# Altium schematic sheet [05] - PROFINET.SchDoc
size A3; DocumentNumber: 6; SheetNumber: 6; SheetTotal: 12
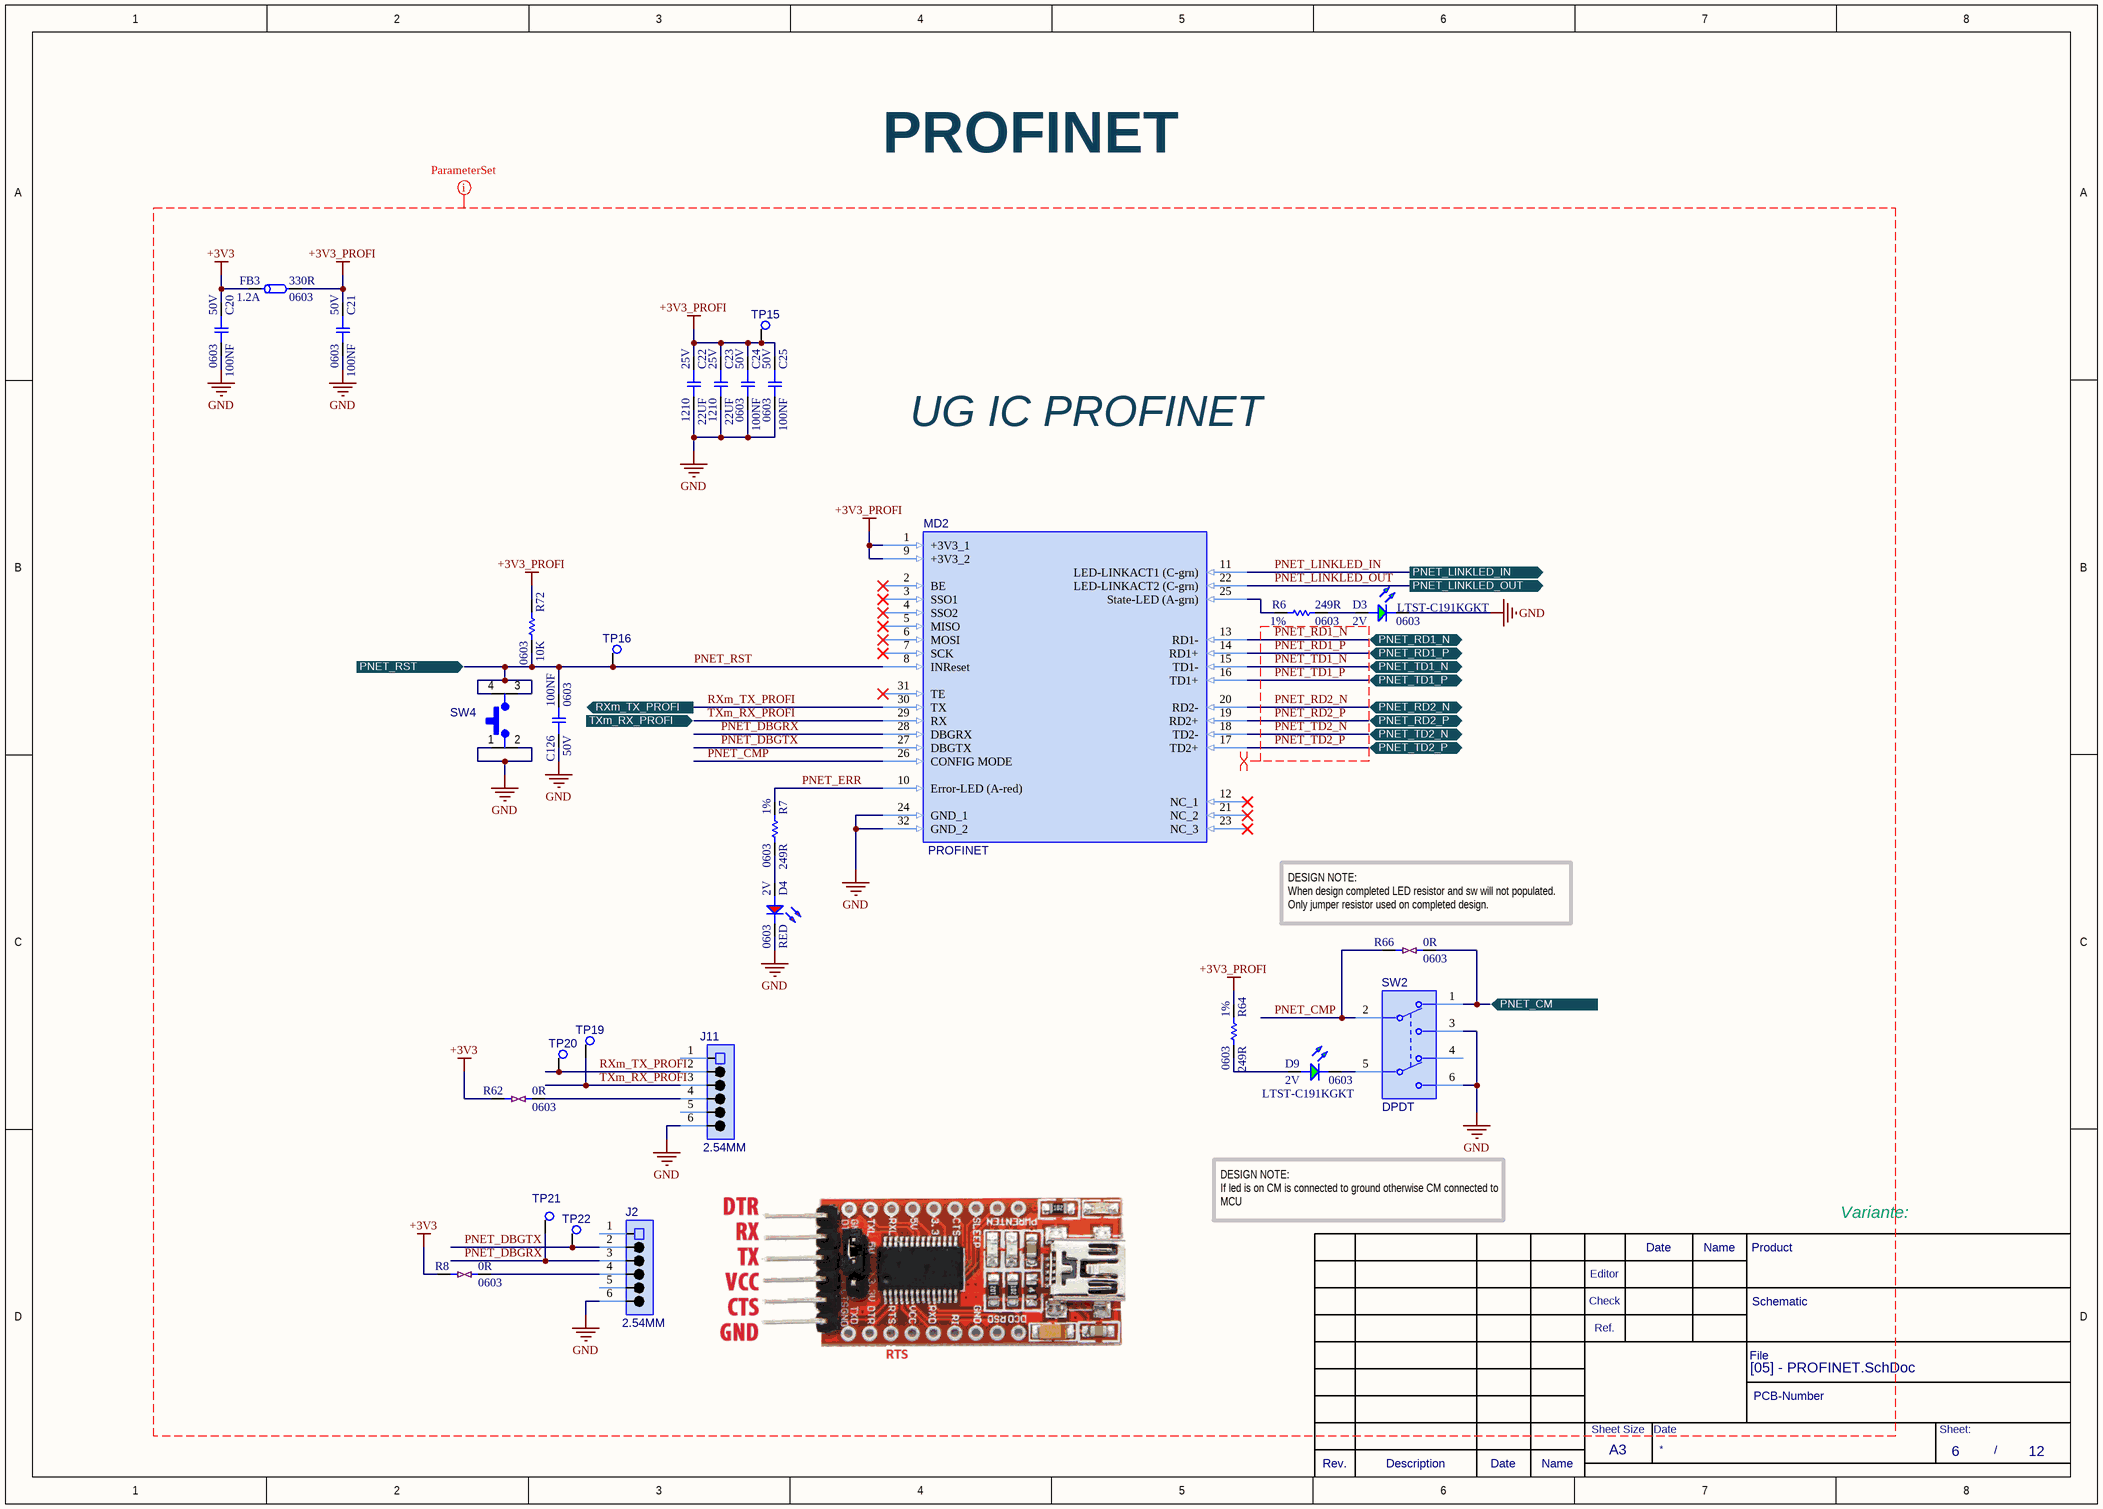
[diagram p0: [05] - PROFINET.SchDoc]

## Parts
C20  100NF  Voltage Rating: 50V  Case Code (Imperial): 0603  [C-0603]
C21  100NF  Voltage Rating: 50V  Case Code (Imperial): 0603  [C-0603]
C22  22UF  Voltage Rating: 25V  Case Code (Imperial): 1210  [C-1210]
C23  22UF  Voltage Rating: 25V  Case Code (Imperial): 1210  [C-1210]
C24  100NF  Voltage Rating: 50V  Case Code (Imperial): 0603  [C-0603]
C25  100NF  Voltage Rating: 50V  Case Code (Imperial): 0603  [C-0603]
C126  100NF  Voltage Rating: 50V  Case Code (Imperial): 0603  [C-0603]
D3  LTST-C191KGKT  Forward Voltage: 2V  Case Code (Imperial): 0603  [LED-0603-GREEN]
D4  RED  Case/Package: 0603  Forward Voltage: 2V  [LED-0603]
D9  LTST-C191KGKT  Forward Voltage: 2V  Case Code (Imperial): 0603  [LED-0603-GREEN]
FB3  330R  Case/Package: 0603  DC Current: 1.2A  [FB-0603]
J2  2.54MM  [CON-1X6-VERT-2.54MM]
J11  2.54MM  [CON-1X6-VERT-2.54MM]
MD2  PROFINET  [MD-UG-IC-PIN]
R6  249R  Tolerance: 1%  Case/Package: 0603  [R-0603]
R7  249R  Tolerance: 1%  Case/Package: 0603  [R-0603]
R8  0R  Case Code (Imperial): 0603  [JMP-0603]
R62  0R  Case Code (Imperial): 0603  [JMP-0603]
R64  249R  Tolerance: 1%  Case/Package: 0603  [R-0603]
R66  0R  Case Code (Imperial): 0603  [JMP-0603]
R72  10K  Case Code (Imperial): 0603  [R-0603]
SW2  DPDT  [SW-AYZ0202AGRLC]
SW4  SW-TACTILE-5MM  [TACTILE_SMD_V2]  (value not drawn)
TP15  MECH-TESTPOINT  [MECH-TESTPOINT]  (value not drawn)  (no BOM)
TP16  MECH-TESTPOINT  [MECH-TESTPOINT]  (value not drawn)  (no BOM)
TP19  MECH-TESTPOINT  [MECH-TESTPOINT]  (value not drawn)  (no BOM)
TP20  MECH-TESTPOINT  [MECH-TESTPOINT]  (value not drawn)  (no BOM)
TP21  MECH-TESTPOINT  [MECH-TESTPOINT]  (value not drawn)  (no BOM)
TP22  MECH-TESTPOINT  [MECH-TESTPOINT]  (value not drawn)  (no BOM)

## Ports
PNET_CM (in), PNET_LINKLED_IN (out), PNET_LINKLED_OUT (out), PNET_RD1_N (bidir), PNET_RD1_P (bidir), PNET_RD2_N (bidir), PNET_RD2_P (bidir), PNET_RST (in), PNET_TD1_N (bidir), PNET_TD1_P (bidir), PNET_TD2_N (bidir), PNET_TD2_P (bidir), RXm_TX_PROFI (out), TXm_RX_PROFI (in)

## Nets
+3V3: C20.1 FB3.1 R8.1 R62.1
+3V3_PROFI: C21.1 C22.1 C23.1 C24.1 C25.1 FB3.2 MD2.1(+3V3_1) MD2.9(+3V3_2) R64.1 R72.1 TP15.1
GND: C20.2 C21.2 C22.2 C23.2 C24.2 C25.2 C126.1 D3.C D4.C J2.6 J11.6 MD2.24(GND_1) MD2.32(GND_2) SW2.3 SW2.6 SW4.1 SW4.2
PNET_CM: R66.2 SW2.1 ; port PNET_CM
PNET_CMP: MD2.26(CONFIG_MODE) R66.1 SW2.2
PNET_DBGRX: J2.3 MD2.28(DBGRX) TP21.1
PNET_DBGTX: J2.2 MD2.27(DBGTX) TP22.1
PNET_ERR: MD2.10(Error-LED_(A-red)) R7.1
PNET_LINKLED_IN: MD2.11(LED-LINKACT1_(C-grn)) ; port PNET_LINKLED_IN
PNET_LINKLED_OUT: MD2.22(LED-LINKACT2_(C-grn)) ; port PNET_LINKLED_OUT
PNET_RD1_N: MD2.13(RD1-) ; port PNET_RD1_N
PNET_RD1_P: MD2.14(RD1+) ; port PNET_RD1_P
PNET_RD2_N: MD2.20(RD2-) ; port PNET_RD2_N
PNET_RD2_P: MD2.19(RD2+) ; port PNET_RD2_P
PNET_RST: C126.2 MD2.8(INReset) R72.2 SW4.3 SW4.4 TP16.1 ; port PNET_RST
PNET_TD1_N: MD2.15(TD1-) ; port PNET_TD1_N
PNET_TD1_P: MD2.16(TD1+) ; port PNET_TD1_P
PNET_TD2_N: MD2.18(TD2-) ; port PNET_TD2_N
PNET_TD2_P: MD2.17(TD2+) ; port PNET_TD2_P
RXm_TX_PROFI: J11.2 MD2.30(TX) TP20.1 ; port RXm_TX_PROFI
TXm_RX_PROFI: J11.3 MD2.29(RX) TP19.1 ; port TXm_RX_PROFI
NetD3_A: D3.A R6.2
NetD4_A: D4.A R7.2
NetD9_A: D9.A R64.2
NetD9_C: D9.C SW2.5
NetJ2_4: J2.4 R8.2
NetJ11_4: J11.4 R62.2
NetMD2_25: MD2.25(State-LED_(A-grn)) R6.1

Not connected (* = marked no-connect by the designer): J2 1(GND_IN) 5; J11 1(GND_IN) 5; MD2 2(BE)* 3(SSO1)* 4(SSO2)* 5(MISO)* 6(MOSI)* 7(SCK)* 12(NC_1)* 21(NC_2)* 23(NC_3)* 31(TE)*; SW2 4

## Layout directives
differential pair; differential pair class DIFF90: PNET_RD1_N, PNET_RD1_P, PNET_RD2_N, PNET_RD2_P, PNET_TD1_N, PNET_TD1_P, PNET_TD2_N, PNET_TD2_P
net class PROFINET: +3V3, +3V3_PROFI, GND, PNET_CMP, PNET_DBGRX, PNET_DBGTX, PNET_ERR, PNET_LINKLED_IN, PNET_LINKLED_OUT, PNET_RD1_N, PNET_RD1_P, PNET_RD2_N, PNET_RD2_P, PNET_RST, PNET_TD1_N, PNET_TD1_P, PNET_TD2_N, PNET_TD2_P, RXm_TX_PROFI, TXm_RX_PROFI

## Notes on the sheet
- PROFINET
- UG IC PROFINET
- (near R66) DESIGN NOTE:
  When design completed LED resistor and sw will not populated.
  Only jumper resistor used on completed design.
- DESIGN NOTE:
  If led is on CM is connected to ground otherwise CM connected to MCU
- Date
- Name
- Product
- Variante:
- Editor
- Check
- Ref.
- Schematic
- File
- PCB-Number
- Rev.
- Description
- Sheet Size
- A3
- Sheet:
- /

## Library data of the parts
C20 C21 C24 C25 = C-100NF-0603: CAP CER 0.1UF 50V X7R 0603; Manufacturer: TDK; Manufacturer Part Number: C1608X7R1H104K080AA; Tolerance: 10%; Dielectric Material: Ceramic; .PCBCHK: USED; .Creator: F:TALI; Washability: OK; Temperature Coefficient: 30ppm/°C; Mount: Surface Mount; Case/Package: 0603; Case Code (Metric): 1608; Min Operating Temperature: -55°C; Max Operating Temperature: 125°C; Package Quantity: 1; Packaging: Tape and Reel; Features: Soft Termination; Length: 1.6mm; Width: 0.8mm; Thickness: 0.037inch; Lead Free: Lead Free; Capacitance: 100nF; Supplier 1: Digi-Key; Supplier Part Number 1: 445-1314-1-ND; Stock 1: 0; Pricing 1: 1=0.1, 10=0.057, 100=0.0254, 500=0.01812, 1000=0.01423 (USD); Contact Plating: Matte,Tin; Voltage Rating (DC): 50V; Dielectric: X7R; Termination: SMD/SMT; Voltage: 50V; Height: 0.8mm; Depth: 0.8mm; REACH SVHC: No SVHC; ComponentLink1URL: http://www.mouser.com/ds/2/400/lcc_commercial_general_en-837201.pdf; ComponentLink1Description: http://www.mouser.com/ds/2/400/lcc_commercial_general_en-837201.pdf; ComponentLink2URL: https://product.tdk.com/info/en/catalog/spec/mlccspec_commercial_general_midvoltage_en.pdf; ComponentLink2Description: https://product.tdk.com/info/en/catalog/spec/mlccspec_commercial_general_midvoltage_en.pdf; Supplier 2: Digi-Key; Supplier Part Number 2: 478-3540-6-ND; Stock 2: 40000; Pricing 2: 1=0.23, 10=0.161, 100=0.0756, 500=0.05304, 1000=0.0439 (USD); Number of Pins: 2; Radiation Hardening: No; ComponentLink3URL: http://uk.rs-online.com/webdocs/13d1/0900766b813d1103.pdf; ComponentLink3Description: http://uk.rs-online.com/webdocs/13d1/0900766b813d1103.pdf; ComponentLink4URL: http://www.tdk.co.jp/tefe02/e412_c.pdf; ComponentLink4Description: http://www.tdk.co.jp/tefe02/e412_c.pdf; ComponentLink5URL: http://www.farnell.com/datasheets/2291921.pdf; ComponentLink5Description: http://www.farnell.com/datasheets/2291921.pdf; ComponentLink6URL: http://www.farnell.com/datasheets/1744655.pdf; ComponentLink6Description: http://www.farnell.com/datasheets/1744655.pdf; ComponentLink7URL: http://catalogs.avx.com/SurfaceMount.pdf; ComponentLink7Description: http://catalogs.avx.com/SurfaceMount.pdf; ComponentLink8URL: http://www.farnell.com/datasheets/630895.pdf; ComponentLink8Description: http://www.farnell.com/datasheets/630895.pdf; ComponentLink9URL: http://www.avx.com/docs/Catalogs/cx7r.pdf; ComponentLink9Description: http://www.avx.com/docs/Catalogs/cx7r.pdf; ComponentLink10URL: http://www.avx.com/docs/catalogs/cauto.pdf; ComponentLink10Description: http://www.avx.com/docs/catalogs/cauto.pdf; .SCHCHK: USED; Weight: 7.1E-05oz; Composition: Ceramic; ComponentLink11URL: https://www.verical.com/server-webapp/html/getDatasheet?partID=98691; ComponentLink11Description: https://www.verical.com/server-webapp/html/getDatasheet?partID=98691; ComponentLink12URL: https://www.avx.com/docs/Catalogs/flexiterm.pdf; ComponentLink12Description: https://www.avx.com/docs/Catalogs/flexiterm.pdf
C22 C23 = C-22UF-1210: CAP CER 22UF 25V X7R 1210; Manufacturer: Samsung; Manufacturer Part Number: CL32B226KAJNNNE; Material: Ceramic; Tolerance: 10%; .PCBCHK: CHECKED; .Creator: F:TALI; Washability: OK; Supplier 1: Digi-Key; Supplier Part Number 1: 1276-3392-1-ND; Stock 1: 0; Pricing 1: 1=1.02, 10=0.777, 100=0.556, 500=0.43042 (USD); Mount: Surface Mount; Case/Package: 1210; Case Code (Metric): 3225; Min Operating Temperature: -55°C; Max Operating Temperature: 125°C; Package Quantity: 1; Packaging: Tape and Reel; Capacitance: 22uF; Dielectric: X7R; Voltage Rating (DC): 25V; Length: 3.2mm; Height: 2.5mm; Width: 0.098inch; Thickness: 0.106inch; Depth: 2.5mm; Radiation Hardening: No; Lead Free: Lead Free; ComponentLink1URL: https://media.digikey.com/pdf/Data%20Sheets/Samsung%20PDFs/CL_Series_MLCC_ds.pdf; ComponentLink1Description: https://media.digikey.com/pdf/Data%20Sheets/Samsung%20PDFs/CL_Series_MLCC_ds.pdf; Supplier 2: Digi-Key; Supplier Part Number 2: 1276-3391-6-ND; Stock 2: 0; Pricing 2: 1=0.91, 10=0.671, 100=0.4598, 500=0.36402 (USD); ComponentLink2URL: http://www.samsungsem.com/kr/support/product-search/mlcc/CL32B226KAJNFNE.jsp; ComponentLink2Description: http://www.samsungsem.com/kr/support/product-search/mlcc/CL32B226KAJNFNE.jsp; Supplier 3: Digi-Key; Supplier Part Number 3: 399-11958-6-ND; Stock 3: 0; Pricing 3: 1=1.63, 10=1.289, 100=0.9664, 500=0.7302 (USD); Dielectric Material: Ceramic; Voltage: 25V; Dissipation Factor: 10%; Termination: SMD/SMT; .SCHCHK: CHECKED
C126 = C-100NF-0603: CAP CER 0.1UF 50V X7R 0603; Manufacturer: TDK; Manufacturer Part Number: C1608X7R1H104K080AA; Dielectric Material: Ceramic; Tolerance: 10%; Temperature Coefficient: 30ppm/°C; .PCBCHK: USED; .Creator: F:TALI; Washability: OK; Supplier 1: Digi-Key; Supplier Part Number 1: 445-1314-1-ND; Stock 1: 0; Pricing 1: 1=0.1, 10=0.057, 100=0.0254, 500=0.01812, 1000=0.01423 (USD); Mount: Surface Mount; Case/Package: 0603; Number of Pins: 2; Weight: 7.1E-05oz; Case Code (Metric): 1608; Min Operating Temperature: -55°C; Max Operating Temperature: 125°C; Capacitance: 100nF; Dielectric: X7R; Packaging: Tape and Reel; Package Quantity: 1; Termination: SMD/SMT; Voltage: 50V; Voltage Rating (DC): 50V; Composition: Ceramic; Length: 1.6mm; Height: 0.8mm; Depth: 0.8mm; Width: 0.8mm; Thickness: 0.037inch; Radiation Hardening: No; REACH SVHC: No SVHC; Lead Free: Lead Free; ComponentLink1URL: http://www.mouser.com/ds/2/400/lcc_commercial_general_en-837201.pdf; ComponentLink1Description: http://www.mouser.com/ds/2/400/lcc_commercial_general_en-837201.pdf; ComponentLink2URL: https://product.tdk.com/info/en/catalog/spec/mlccspec_commercial_general_midvoltage_en.pdf; ComponentLink2Description: https://product.tdk.com/info/en/catalog/spec/mlccspec_commercial_general_midvoltage_en.pdf; ComponentLink3URL: http://uk.rs-online.com/webdocs/13d1/0900766b813d1103.pdf; ComponentLink3Description: http://uk.rs-online.com/webdocs/13d1/0900766b813d1103.pdf; ComponentLink4URL: http://www.tdk.co.jp/tefe02/e412_c.pdf; ComponentLink4Description: http://www.tdk.co.jp/tefe02/e412_c.pdf; ComponentLink5URL: http://www.farnell.com/datasheets/2291921.pdf; ComponentLink5Description: http://www.farnell.com/datasheets/2291921.pdf; ComponentLink6URL: http://www.farnell.com/datasheets/1744655.pdf; ComponentLink6Description: http://www.farnell.com/datasheets/1744655.pdf; Supplier 2: Digi-Key; Supplier Part Number 2: 478-3540-6-ND; Stock 2: 40000; Pricing 2: 1=0.23, 10=0.161, 100=0.0756, 500=0.05304, 1000=0.0439 (USD); Contact Plating: Matte,Tin; Features: Soft Termination; ComponentLink7URL: http://catalogs.avx.com/SurfaceMount.pdf; ComponentLink7Description: http://catalogs.avx.com/SurfaceMount.pdf; ComponentLink8URL: http://www.farnell.com/datasheets/630895.pdf; ComponentLink8Description: http://www.farnell.com/datasheets/630895.pdf; ComponentLink9URL: http://www.avx.com/docs/Catalogs/cx7r.pdf; ComponentLink9Description: http://www.avx.com/docs/Catalogs/cx7r.pdf; ComponentLink10URL: http://www.avx.com/docs/catalogs/cauto.pdf; ComponentLink10Description: http://www.avx.com/docs/catalogs/cauto.pdf; ComponentLink11URL: https://www.verical.com/server-webapp/html/getDatasheet?partID=98691; ComponentLink11Description: https://www.verical.com/server-webapp/html/getDatasheet?partID=98691; ComponentLink12URL: https://www.avx.com/docs/Catalogs/flexiterm.pdf; ComponentLink12Description: https://www.avx.com/docs/Catalogs/flexiterm.pdf; .SCHCHK: USED
D3 D9 = LED-GREEN-0603: LED GREEN CLEAR 0603 SMD; Manufacturer: Vishay Lite-On; Viewing Angle: 130°; Lens Colour: Clear,Colorless; Power Rating: 75mW; Luminous Intensity: 35mcd; Lens Style: Clear,Colorless,Diffused,Rectangular; Forward Current: 30mA; Dominant Wavelength: 571nm; Test Current: 20mA; Number of Elements: 1; Wavelength: 574nm; Reverse Voltage: 5V; .PCBCHK: USED; .Creator: F:TALI; Washability: OK; ComponentLink1Description: http://www.mouser.com/ds/2/239/LTST-C191KGKT-1141954.pdf; ComponentLink1URL: http://www.mouser.com/ds/2/239/LTST-C191KGKT-1141954.pdf; ComponentLink2URL: http://optoelectronics.liteon.com/upload/download/DS22-2000-228/LTST-C191KGKT.PDF; ComponentLink2Description: http://optoelectronics.liteon.com/upload/download/DS22-2000-228/LTST-C191KGKT.PDF; Packaging: Tape and Reel; Supplier 1: Digi-Key; Supplier Part Number 1: 160-1446-1-ND; Manufacturer Part Number: LTST-C191KGKT; Stock 1: 2123523; Pricing 1: 1=0.29, 10=0.215, 25=0.16, 100=0.1153, 250=0.0798, 500=0.07088, 1000=0.05644, 2500=0.05533 (USD); Mount: Surface Mount; Case/Package: 0603; Number of Pins: 2; Colour: Green; Case Code (Metric): 1608; Min Operating Temperature: -55°C; Max Operating Temperature: 85°C; Package Quantity: 1; Illumination Colour: Green; Lens Transparency: Clear; Power Dissipation: 75mW; Number of LEDs: 1; Length: 1.6mm; Height: 0.55mm; Width: 0.8mm; Depth: 0.8mm; Radiation Hardening: No; Lead Free: Lead Free; ComponentLink3URL: https://www.verical.com/server-webapp/html/getDatasheet?partID=103913; ComponentLink3Description: https://www.verical.com/server-webapp/html/getDatasheet?partID=103913; ComponentLink4URL: http://uk.rs-online.com/webdocs/0dc0/0900766b80dc02b1.pdf; ComponentLink4Description: http://uk.rs-online.com/webdocs/0dc0/0900766b80dc02b1.pdf; ComponentLink5URL: http://www1.futureelectronics.com/doc/LITE-ON/LTST-C191KGKT.pdf; ComponentLink5Description: http://www1.futureelectronics.com/doc/LITE-ON/LTST-C191KGKT.pdf; .SCHCHK: USED
D4 = LED-RED-0603: LED RED CLEAR 0603 SMD; Manufacturer: Wurth Electronics; Manufacturer Part Number: 150060RS75000; Viewing Angle: 140°; Lens Style: Clear,Rectangular; Luminous Intensity: 250mcd; Forward Current: 30mA; Wavelength: 625nm; Test Current: 20mA; ComponentLink1Description: https://datasheet.ciiva.com/29563/150060rs75000-29563040.pdf?src-supplier=Digi-Key; ComponentLink1URL: https://datasheet.ciiva.com/29563/150060rs75000-29563040.pdf?src-supplier=Digi-Key; ComponentLink2URL: https://datasheet.ciiva.com/29279/759428-da-01-en-chipled-0603-w-kl-rot-150060rs75000-29279196.pdf?src-supplier=Conrad; ComponentLink2Description: https://datasheet.ciiva.com/29279/759428-da-01-en-chipled-0603-w-kl-rot-150060rs75000-29279196.pdf?src-supplier=Conrad; Packaging: Cut Tape; Supplier 1: Digi-Key; Supplier Part Number 1: 732-4978-1-ND; Stock: 110086; Pricing: 1=0.14, 50=0.133, 100=0.114, 500=0.099 (USD); RoHS: Yes; Mount: Surface Mount; Color: Red; Case Code (Metric): 1608; Case Code (Imperial): 0603; Min Operating Temperature: -40°C; Max Operating Temperature: 85°C; Package Quantity: 1; Dominant Wavelength: 625nm; Length: 1.6mm; Height: 0.7mm; Width: 0.8mm; REACH SVHC: Unknown
FB3 = FB-330R-0603: FERRITE BEAD 330 OHM 0603 1LN; Manufacturer: Murata; Manufacturer Part Number: BLM18PG331SN1D; Material: Steel,Ferrite; Tolerance: 25%; DC Resistance (DCR): 150mR; Number of Lines: 1; Test Frequency: 100MHz; Shielding: Unshielded; Washability: OK; .Creator: M.OZKAN; .PCBCHK: USED; Supplier 1: Digi-Key; RoHS: Yes; Number of Pins: 2; Core Material: Ferrite; Case Code (Metric): 1608; Case Code (Imperial): 0603; Min Operating Temperature: -55°C; Max Operating Temperature: 125°C; Impedance: 330R; Package Quantity: 1; Packaging: Tape and Reel; Current Rating: 1.2A; Max Current Rating: 1.2A; Termination: SMD/SMT; Number of Circuits: 1; Length: 1.75mm; Height: 0.8mm; Width: 0.8mm; Depth: 0.95mm; Radiation Hardening: No; REACH SVHC: No SVHC; Lead Free: Lead Free; ComponentLink1URL: https://datasheet.ciiva.com/6211/enfa0003-6211710.pdf?src-supplier=Digi-Key; ComponentLink1Description: https://datasheet.ciiva.com/6211/enfa0003-6211710.pdf?src-supplier=Digi-Key; Supplier Part Number 1: 490-5222-1-ND; Max DC Current: 1.2A; .SCHCHK: USED; Stock: 106218; Pricing: 1=0.1, 10=0.076, 25=0.0684, 50=0.05, 100=0.0433, 250=0.0342, 500=0.0288, 1000=0.0243 (USD)
J2 J11 = CON-6POS-2.54MM: CONN RCPT 6POS 0.1 TIN PCB; Manufacturer 1: Harwin; Manufacturer Part Number: M20-7820646; Number of Contacts: 6; Gender: Female; Connector Type: Receptacle,Socket; Max Current Rating: 3A; Contact Resistance: 20mR; Supplier 1: Digi-Key; RoHS: Yes; Category: Headers and Wire Housings; Stock: 1847; Pricing: 1=0,96000, 10=0,84200, 100=0,72600, 500=0,59400, 1000=0,52800, 5000=0,46200, 10000=0,43890 (USD); Mount: Through Hole; Case/Package: SIL; Housing Material: Nylon; Color: Black; Contact Plating: Tin; Contact Material: Bronze; Housing Color: Black; Min Operating Temperature: -40°C; Max Operating Temperature: 105°C; Termination: Solder; Number of Rows: 1; Number of Positions: 6; Packaging: Rail/Tube; Orientation: Straight; Contact Gender: Female; Package Quantity: 38; Length: 15.64mm; Pitch: 2.54mm; Depth: 2.5mm; Radiation Hardening: No; ComponentLink1URL: http://components.arrow.com/part/dataview/0323_00725884?src-supplier=Arrow+Europe; ComponentLink1Description: http://components.arrow.com/part/dataview/0323_00725884?src-supplier=Arrow+Europe; ComponentLink2URL: http://www.harwin.com/include/downloads/pdfs/2010PAGE120.PDF?src-supplier=Avnet; ComponentLink2Description: http://www.harwin.com/include/downloads/pdfs/2010PAGE120.PDF?src-supplier=Avnet; ComponentLink3URL: https://cdn.harwin.com/pdfs/M20-782.pdf?src-supplier=Digi-Key; ComponentLink3Description: https://cdn.harwin.com/pdfs/M20-782.pdf?src-supplier=Digi-Key; ComponentLink4URL: https://cdn.harwin.com/pdfs/Harwin_PC_Connectors_M20.pdf?src-supplier=Avnet+Europe; ComponentLink4Description: https://cdn.harwin.com/pdfs/Harwin_PC_Connectors_M20.pdf?src-supplier=Avnet+Europe; ComponentLink5URL: https://cdn.harwin.com/pdfs/Harwin_PC_Connectors_M20.pdf?src-supplier=RSComponents; ComponentLink5Description: https://cdn.harwin.com/pdfs/Harwin_PC_Connectors_M20.pdf?src-supplier=RSComponents; ComponentLink6URL: https://cdn.harwin.com/pdfs/Harwin_PC_Connectors_M20.pdf?src-supplier=Mouser; ComponentLink6Description: https://cdn.harwin.com/pdfs/Harwin_PC_Connectors_M20.pdf?src-supplier=Mouser; ComponentLink7URL: https://cdn.harwin.com/pdfs/Harwin_PC_Connectors_M20.pdf?src-supplier=TTI; ComponentLink7Description: https://cdn.harwin.com/pdfs/Harwin_PC_Connectors_M20.pdf?src-supplier=TTI; Supplier Part Number 1: 952-1809-ND
MD2 = MD-UG IC PROFINET: UNIGATE® IC - PROFINET 2Port; ComponentLink1Description: Datasheet; ComponentLink1URL: https://www.deutschmann.de/en/products/embedded-solutions/unigate-ic/unigate-ic-profinet/?pdf=1&id=0&bs2=0; ComponentLink2Description: Manuel; ComponentLink2URL: https://www.deutschmann.de/downloads//Marketing/Anleitung-Instructions/Handbuecher-Manuals/Gateway/English/UNIGATE%20IC/IC%20PROFINET/IC_PN2Port/IC_PN2Port_e.pdf
R6 R7 R64 = R-249R-0603: RES 249 OHM 1% 1/10W 0603; Manufacturer: Stackpole Electronics; Manufacturer Part Number: RMCF0603FT249R; Power Rating: 100mW; Temperature Coefficient: 100ppm/°C; Supplier 1: Digi-Key; Supplier Part Number 1: RMCF0603FT249RCT-ND; Stock: 137849; Pricing: 1=0.1, 10=0.015, 100=0.0063, 1000=0.0028, 2500=0.0024 (USD); RoHS: Yes; Mount: Surface Mount; Case Code (Metric): 1608; Case Code (Imperial): 0603; Contact Plating: Tin,Matte; Min Operating Temperature: -55°C; Max Operating Temperature: 155°C; Packaging: Tape and Reel; Resistance: 249R; Max Power Dissipation: 100mW; Features: Automotive AEC-Q200; Composition: Thick Film; Number of Terminations: 2; Length: 0.061inch; Height: 0.022inch; Width: 0.031inch; Radiation Hardening: No; Lead Free: Lead Free; ComponentLink1URL: http://components.arrow.com/part/dataview/50577616S9712727N1174?src-supplier=Arrow+Electronics; ComponentLink1Description: http://components.arrow.com/part/dataview/50577616S9712727N1174?src-supplier=Arrow+Electronics; ComponentLink2URL: https://www.seielect.com/catalog/SEI-RMCF_RMCP.pdf?src-supplier=Avnet; ComponentLink2Description: https://www.seielect.com/catalog/SEI-RMCF_RMCP.pdf?src-supplier=Avnet; ComponentLink3URL: https://www.seielect.com/Catalog/SEI-RMCF_RMCP.pdf?src-supplier=Digi-Key; ComponentLink3Description: https://www.seielect.com/Catalog/SEI-RMCF_RMCP.pdf?src-supplier=Digi-Key; ComponentLink4URL: https://www.seielect.com/catalog/SEI-Packaging.pdf?src-supplier=Digi-Key; ComponentLink4Description: https://www.seielect.com/catalog/SEI-Packaging.pdf?src-supplier=Digi-Key; ComponentLink5URL: http://www.seielect.com/Catalog/SEI-RMC.pdf?src-supplier=Future+Electronics; ComponentLink5Description: http://www.seielect.com/Catalog/SEI-RMC.pdf?src-supplier=Future+Electronics
R8 R62 R66 = R-0R-0603: RES SMD 0 OHM 1/10W JUMP 0603; Manufacturer: Yageo; Manufacturer Part Number: RC0603JR-070RL; Resistance: 0mR; Tolerance: 1%; Power Rating: 100mW; Voltage Rating: 50V; Temperature Coefficient: 200ppm/°C; Current Rating: 1A; Working Voltage: 75V; .PCBCHK: USED; .Creator: F:TALI; Washability: OK; Supplier 1: Digi-Key; Supplier Part Number 1: 311-0.0GRDKR-ND; Stock 1: 54397731; Pricing 1: 1=0.1, 10=0.021, 25=0.0152, 50=0.0114, 100=0.0084, 250=0.00644, 500=0.00514, 1000=0.00379 (USD); Case/Package: 0603; Number of Pins: 2; Contact Plating: Matte,Tin; Case Code (Metric): 1608; Min Operating Temperature: -55°C; Max Operating Temperature: 155°C; Composition: Thick Film; Packaging: Tape and Reel; Voltage Rating (DC): 50V; Termination: SMD/SMT; Military Standard: Not; Length: 1.6mm; Height: 0.45mm; Width: 0.8mm; Depth: 0.8mm; Radiation Hardening: No; REACH SVHC: No SVHC; Lead Free: Lead Free; ComponentLink1URL: http://www.farnell.com/datasheets/1738695.pdf; ComponentLink1Description: http://www.farnell.com/datasheets/1738695.pdf; ComponentLink2URL: https://www.verical.com/server-webapp/html/getDatasheet?partID=329462; ComponentLink2Description: https://www.verical.com/server-webapp/html/getDatasheet?partID=329462; ComponentLink3URL: http://www.yageo.com/documents/recent/PYu-RC_Group_51_RoHS_L_9.pdf; ComponentLink3Description: http://www.yageo.com/documents/recent/PYu-RC_Group_51_RoHS_L_9.pdf; Supplier Part Number 2: 311-0.0HRDKR-ND; Stock 2: 6104331; Pricing 2: 1=0.1, 10=0.021, 25=0.0152, 50=0.0114, 100=0.0084, 250=0.00644, 500=0.00514, 1000=0.00379 (USD); Supplier 2: Digi-Key; Package Quantity: 5000; Number of Terminations: 2; Max Power Dissipation: 100mW; Features: Moisture Resistant; ComponentLink4URL: http://www.farnell.com/datasheets/443971.pdf; ComponentLink4Description: http://www.farnell.com/datasheets/443971.pdf; ComponentLink5URL: http://documents.rs-components.com/techlib://itc_doclist_GB.htm?stockno=6515918; ComponentLink5Description: http://documents.rs-components.com/techlib://itc_doclist_GB.htm?stockno=6515918; ComponentLink6URL: http://www.farnell.com/datasheets/1868787.pdf; ComponentLink6Description: http://www.farnell.com/datasheets/1868787.pdf; ComponentLink7URL: http://documents.rs-components.com/techlib://itc_doclist_GB.htm?stockno=5048827; ComponentLink7Description: http://documents.rs-components.com/techlib://itc_doclist_GB.htm?stockno=5048827; Supplier 3: Digi-Key; Supplier Part Number 3: P0.0GDKR-ND; Stock 3: 34178498; Pricing 3: 1=0.1, 10=0.042, 25=0.0304, 50=0.0232, 100=0.0171, 250=0.01308, 500=0.01046, 1000=0.0077 (USD); Mount: Surface Mount; ComponentLink8URL: http://industrial.panasonic.com/www-data/pdf/AOA0000/AOA0000CE1.pdf; ComponentLink8Description: http://industrial.panasonic.com/www-data/pdf/AOA0000/AOA0000CE1.pdf; ComponentLink9URL: http://www.farnell.com/datasheets/2059623.pdf; ComponentLink9Description: http://www.farnell.com/datasheets/2059623.pdf; ComponentLink10URL: http://www.jameco.com/Jameco/Products/ProdDS/1935748.pdf; ComponentLink10Description: http://www.jameco.com/Jameco/Products/ProdDS/1935748.pdf; ComponentLink11URL: http://www.farnell.com/datasheets/1678796.pdf; ComponentLink11Description: http://www.farnell.com/datasheets/1678796.pdf; .SCHCHK: USED; ComponentLink12URL: http://www.alliedelec.com/m/d/51cd0790071e1666bdb9d00c57fcf960.pdf; ComponentLink12Description: http://www.alliedelec.com/m/d/51cd0790071e1666bdb9d00c57fcf960.pdf
R72 = R-10K-0603: RES SMD 10K OHM 1% 1/10W 0603; Manufacturer: Yageo; Manufacturer Part Number: RC0603FR-0710KL; Resistance: 10kR; Temperature Coefficient: 100ppm/°C; Voltage Rating (DC): 50V; Power Rating: 100mW; Voltage Rating: 75V; .PCBCHK: USED; .Creator: F:TALI; Washability: OK; Supplier 1: Digi-Key; Supplier Part Number 1: 311-10.0KHRCT-ND; Stock 1: 37479107; Pricing 1: 1=0.1, 10=0.026, 100=0.0107, 1000=0.00478, 2500=0.00415 (USD); Case/Package: 0603; Number of Pins: 2; Weight: 7.1E-05oz; Case Code (Metric): 1608; Min Operating Temperature: -55°C; Max Operating Temperature: 155°C; Tolerance: 1%; Composition: Thick Film; Packaging: Tape and Reel; Military Standard: Not; Termination: SMD/SMT; Length: 1.6mm; Height: 0.45mm; Width: 0.8mm; Depth: 0.8mm; Lead Pitch: 0.3mm; REACH SVHC: No SVHC; Lead Free: Lead Free; ComponentLink1URL: http://www.farnell.com/datasheets/38590.pdf; ComponentLink1Description: http://www.farnell.com/datasheets/38590.pdf; ComponentLink2URL: https://www.verical.com/server-webapp/html/getDatasheet?partID=409289; ComponentLink2Description: https://www.verical.com/server-webapp/html/getDatasheet?partID=409289; ComponentLink3URL: http://www.farnell.com/datasheets/1868787.pdf; ComponentLink3Description: http://www.farnell.com/datasheets/1868787.pdf; ComponentLink4URL: http://www.farnell.com/datasheets/443971.pdf; ComponentLink4Description: http://www.farnell.com/datasheets/443971.pdf; ComponentLink5URL: http://www.farnell.com/datasheets/1738695.pdf; ComponentLink5Description: http://www.farnell.com/datasheets/1738695.pdf; Supplier 2: Digi-Key; Supplier Part Number 2: 311-10KGRDKR-ND; Stock 2: 34952003; Pricing 2: 1=0.1, 10=0.022, 100=0.0088, 1000=0.00396, 2500=0.00344 (USD); Contact Plating: Matte,Tin; Radiation Hardening: No; ComponentLink6URL: http://www.yageo.com/documents/recent/PYu-RC_Group_51_RoHS_L_9.pdf; ComponentLink6Description: http://www.yageo.com/documents/recent/PYu-RC_Group_51_RoHS_L_9.pdf; ComponentLink7URL: https://www.verical.com/server-webapp/html/getDatasheet?partID=327958; ComponentLink7Description: https://www.verical.com/server-webapp/html/getDatasheet?partID=327958; ComponentLink8URL: http://www.yageo.com/documents/recent/PYu-RC_Group_51_RoHS_L_2.pdf; ComponentLink8Description: http://www.yageo.com/documents/recent/PYu-RC_Group_51_RoHS_L_2.pdf; Mount: Surface Mount; Package Quantity: 1; Number of Terminations: 2; Max Power Dissipation: 100mW; Working Voltage: 75V; Features: Automotive AEC-Q200; ComponentLink9URL: http://www.farnell.com/datasheets/1678796.pdf; ComponentLink9Description: http://www.farnell.com/datasheets/1678796.pdf; ComponentLink10URL: http://industrial.panasonic.com/www-cgi/jvcr13pz.cgi?E+PZ+3+AOA0002+ERJ1GNJ120C+7+WW; ComponentLink10Description: http://industrial.panasonic.com/www-cgi/jvcr13pz.cgi?E+PZ+3+AOA0002+ERJ1GNJ120C+7+WW; ComponentLink11URL: http://industrial.panasonic.com/www-data/pdf/AOA0000/AOA0000CE1.pdf; ComponentLink11Description: http://industrial.panasonic.com/www-data/pdf/AOA0000/AOA0000CE1.pdf; ComponentLink12URL: http://www.jameco.com/Jameco/Products/ProdDS/2007265.pdf; ComponentLink12Description: http://www.jameco.com/Jameco/Products/ProdDS/2007265.pdf; ComponentLink13URL: https://industrial.panasonic.com/cdbs/www-data/pdf/RDA0000/AOA0000C301.pdf; ComponentLink13Description: https://industrial.panasonic.com/cdbs/www-data/pdf/RDA0000/AOA0000C301.pdf; Supplier 3: Digi-Key; Supplier Part Number 3: YAG1290DKR-ND; Stock 3: 0; Pricing 3: 1=0.1, 10=0.044, 100=0.0178, 1000=0.00798, 2500=0.00693 (USD); .SCHCHK: USED
SW2 = SW-AYZ0202AGRLC: SWITCH SLIDE DPDT 100MA 12V; Manufacturer: ITT C&K; Mechanical Life: 10000Cycles; Actuator Material: Nylon,Glass,Polyamide,Glass fibre; Actuator Type: Standard; Illumination Type: Non-Illuminated; Contact Resistance: 80mR; Switch Function: On-On; Actuator Length: 1mm; Supplier 1: RSComponents; Supplier Part Number 1: 7931504; Manufacturer Part Number: AYZ0202AGRLC; Stock: 377; Pricing: 1=1.326, 50=1.209, 100=1.105, 1000=1.027, 3000=0.962, 1=10.2, 50=9.3, 100=8.5, 1000=7.9, 3000=7.4 (EUR); RoHS: Yes; Mount: Surface Mount,PCB; Case/Package: 100; Contact Material: Copper Alloy,Brass,Silver; Housing Material: Glass; Contact Plating: Silver; Min Operating Temperature: -10°C; Max Operating Temperature: 60°C; Termination: Gull Wing; Throw Configuration: DPDT; Max Current Rating: 100mA; Max Voltage Rating (DC): 12V; Voltage Rating (DC): 12V; Package Quantity: 1; Packaging: Tape and Reel; Current Rating: 100mA; Contact Current Rating: 100mA; Orientation: Vertical; Length: 7.2mm; Depth: 6mm; Radiation Hardening: No; Lead Free: Lead Free; REACH SVHC: No SVHC; ComponentLink1URL: https://datasheet.ciiva.com/16417/ayz0202agrlc-16417120.pdf?src-supplier=Future+Electronics; ComponentLink1Description: https://datasheet.ciiva.com/16417/ayz0202agrlc-16417120.pdf?src-supplier=Future+Electronics; ComponentLink2URL: https://datasheet.ciiva.com/2889/ayz-16oct13-2889189.pdf?src-supplier=Digi-Key; ComponentLink2Description: https://datasheet.ciiva.com/2889/ayz-16oct13-2889189.pdf?src-supplier=Digi-Key; ComponentLink3URL: https://datasheet.ciiva.com/8624/ayz-16oct13-8624741.pdf?src-supplier=Avnet; ComponentLink3Description: https://datasheet.ciiva.com/8624/ayz-16oct13-8624741.pdf?src-supplier=Avnet; ComponentLink4URL: https://datasheet.ciiva.com/2889/ayz-16oct13-2889190.pdf?src-supplier=Digi-Key; ComponentLink4Description: https://datasheet.ciiva.com/2889/ayz-16oct13-2889190.pdf?src-supplier=Digi-Key; ComponentLink5URL: https://datasheet.ciiva.com/2889/ayz-16oct13-2889191.pdf?src-supplier=Digi-Key; ComponentLink5Description: https://datasheet.ciiva.com/2889/ayz-16oct13-2889191.pdf?src-supplier=Digi-Key; ComponentLink6URL: https://datasheet.ciiva.com/16174/ayz-24mar-16174248.pdf?src-supplier=Onlinecomponents.com; ComponentLink6Description: https://datasheet.ciiva.com/16174/ayz-24mar-16174248.pdf?src-supplier=Onlinecomponents.com; ComponentLink7URL: https://datasheet.ciiva.com/22630/1707705-22630555.pdf?src-supplier=Element14; ComponentLink7Description: https://datasheet.ciiva.com/22630/1707705-22630555.pdf?src-supplier=Element14
SW4 = SW-TACTILE-5MM: SWITCH TACTILE SPST-NO 0.05A 24V; Manufacturer: TE Connectivity AMP; Manufacturer Part Number: FSM4JSMA; Mechanical Life: 100000Cycles; Actuator Material: Polyamide; Operating Force: 1.57N; Throw Configuration: SPST; Max Voltage Rating (DC): 12V; Current Rating: 50mA; Illumination Type: Illuminated,Non-Illuminated; Contact Resistance: 100mR; Switch Travel: 0.25mm; Switch Function: Off-Mom; Actuator Type: Standard; Actuator Length: 0.055inch; .PCBCHK: USED; .Creator: F:TALI; Washability: OK; Supplier 1: Digi-Key; Stock 1: 31344; Pricing 1: 1=0.23, 10=0.218, 25=0.2108, 50=0.2032, 100=0.192, 250=0.18068, 500=0.17314, 1000=0.13174, 5000=0.10916 (USD); Mount: Surface Mount; Case/Package: SMA; Contact Material: Copper Alloy; Contact Plating: Silver; Min Operating Temperature: -35°C; Max Operating Temperature: 85°C; Voltage Rating (DC): 24V; Packaging: Loose Piece; Termination: Gull Wing; Orientation: Straight; Package Quantity: 750; Contact Current Rating: 50mA; Electrical Life: 100000Cycles; Voltage Rating: 24V; Type: Switch; Length: 6mm; Width: 6mm; REACH SVHC: Unknown; ComponentLink1URL: https://www.alliedelec.com/m/d/12a87fa7d0b178a96761783f66d58fa4.pdf; ComponentLink1Description: https://www.alliedelec.com/m/d/12a87fa7d0b178a96761783f66d58fa4.pdf; ComponentLink2URL: http://www.onlinecomponents.com/productFiles/mf-AO/eng_cat_1308390_0904_e3_e10_.pdf; ComponentLink2Description: http://www.onlinecomponents.com/productFiles/mf-AO/eng_cat_1308390_0904_e3_e10_.pdf; ComponentLink3URL: https://www.te.com/commerce/DocumentDelivery/DDEController?Action=srchrtrv&DocNm=1308111-1_SWITCHES_CORE_PROGRAM_CATALOG&DocType=CS&DocLang=English; ComponentLink3Description: https://www.te.com/commerce/DocumentDelivery/DDEController?Action=srchrtrv&DocNm=1308111-1_SWITCHES_CORE_PROGRAM_CATALOG&DocType=CS&DocLang=English; Supplier Part Number 1: 450-1129-ND; .SCHCHK: USED
TP15 TP16 TP19-TP22 = MECH-TESTPOINT: .PCBCHK: USED; .Creator: F:TALI; Washability: OK; .SCHCHK: USED